# Altium schematic sheet Power.SchDoc: 采集板的电源模块
size A4
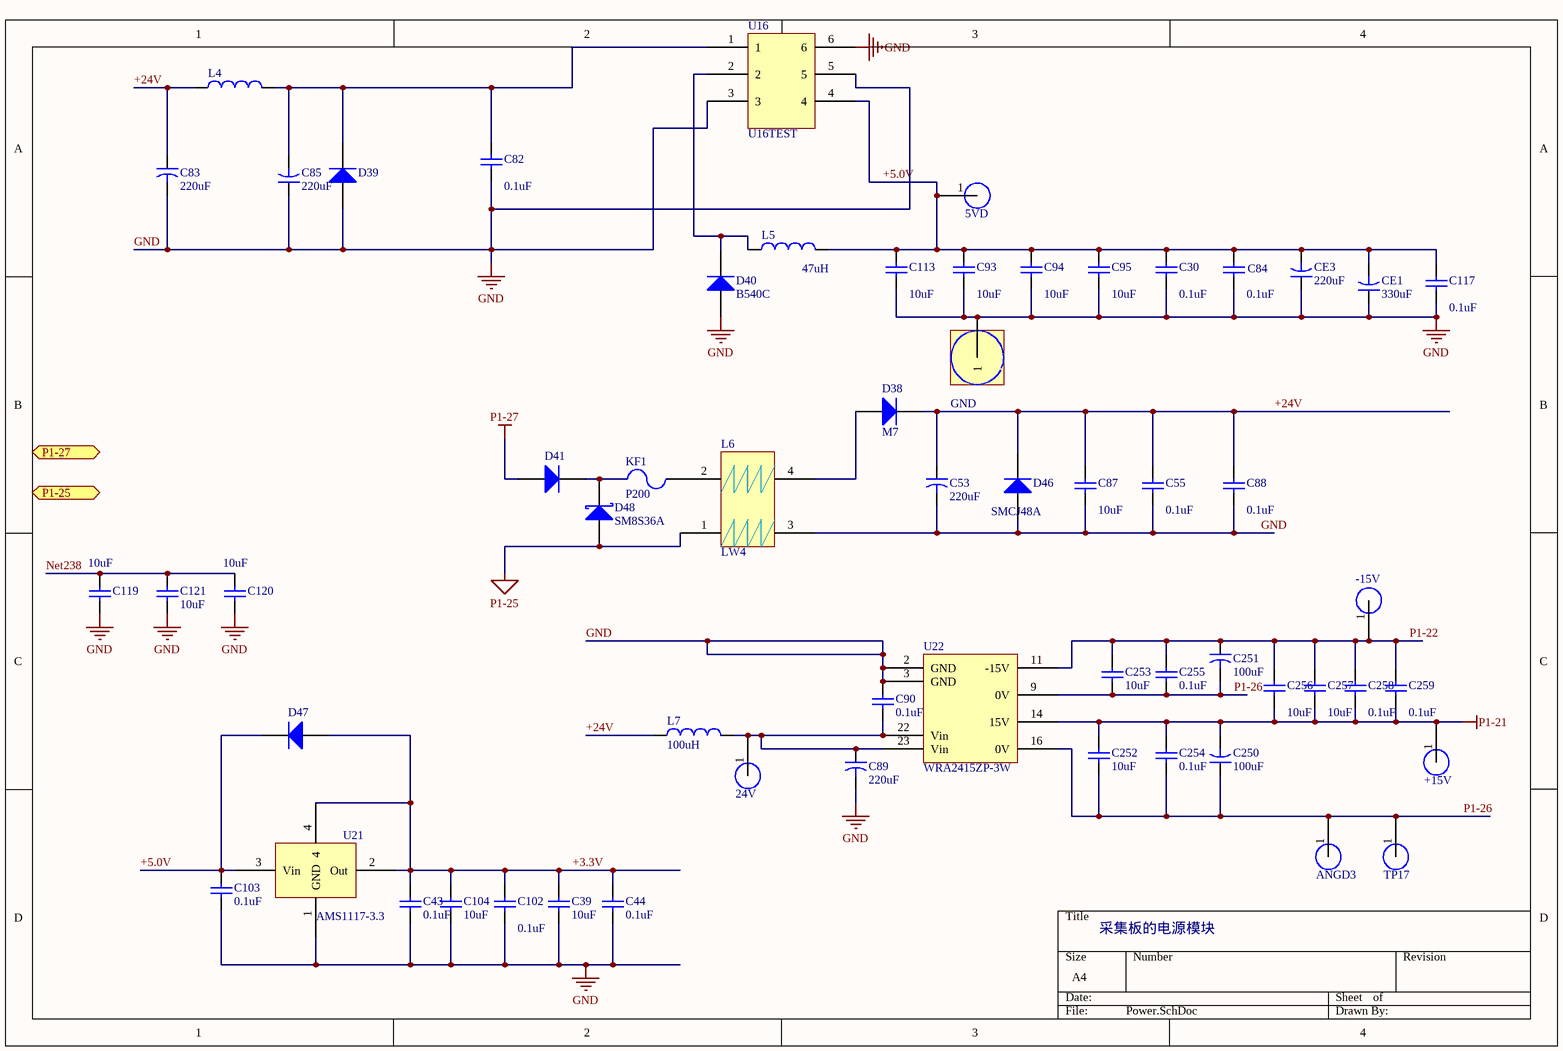
[diagram p0: Power.SchDoc]

## Parts
5VD  PIN  [圆形焊盘]  (value not drawn)
24V  PIN  [圆形焊盘]  (value not drawn)
+15V  PIN  [圆形焊盘]  (value not drawn)
-15V  PIN  [圆形焊盘]  (value not drawn)
ANGD3  PIN  [圆形焊盘]  (value not drawn)
C30  value 0.1uF  [C0805]  (hidden comment: 104/10%)
C39  value 10uF  [C1206]  (hidden comment: Cap)
C43  value 0.1uF  [C0805]  (hidden comment: 104/10%)
C44  value 0.1uF  [C0805]  (hidden comment: Cap)
C53  value 220uF  [8*12]  (hidden comment: Cap2)
C55  value 0.1uF  [C0805]  (hidden comment: 104/10%)
C82  value 0.1uF  [C0805]  (hidden comment: 22pF/5%)
C83  value 220uF  [8*12]  (hidden comment: Cap2)
C84  value 0.1uF  [C0805]  (hidden comment: 104/10%)
C85  value 220uF  [8*12]  (hidden comment: Cap2)
C87  10uF  [C1206]
C88  value 0.1uF  [C0805]  (hidden comment: 104/10%)
C89  value 220uF  [8*12]  (hidden comment: Cap2)
C90  value 0.1uF  [C0805]  (hidden comment: 104/10%)
C93  10uF  [C1206]
C94  10uF  [C1206]
C95  10uF  [C1206]
C102  value 0.1uF  [C0805]  (hidden comment: Cap)
C103  value 0.1uF  [C0805]  (hidden comment: 104/10%)
C104  value 10uF  [C1206]  (hidden comment: Cap)
C113  value 10uF  [C1206]  (hidden comment: Cap)
C117  value 0.1uF  [C0805]  (hidden comment: Cap)
C119  value 10uF  [C1210]  (hidden comment: Cap)
C120  value 10uF  [C1210]  (hidden comment: Cap)
C121  value 10uF  [C1210]  (hidden comment: Cap)
C250  value 100uF  [8*12]  (hidden comment: Cap2)
C251  value 100uF  [8*12]  (hidden comment: Cap2)
C252  10uF  [C1206]
C253  10uF  [C1206]
C254  value 0.1uF  [C0805]  (hidden comment: 104/10%)
C255  value 0.1uF  [C0805]  (hidden comment: 104/10%)
C256  10uF  [C1206]
C257  10uF  [C1206]
C258  value 0.1uF  [C0805]  (hidden comment: 104/10%)
C259  value 0.1uF  [C0805]  (hidden comment: 104/10%)
CE1  value 330uF  [8*12]  (hidden comment: Cap2)
CE3  value 220uF  [8*12]  (hidden comment: Cap2)
D38  M7  [DO214AB]
D39  SMCJ48A  [DO214AB]  (value not drawn)
D40  B540C  [DO214AB]
D41  B540C  [DO214AB]  (value not drawn)
D46  SMCJ48A  [DO214AB]
D47  Diode 1N4007  [SOD123]  (value not drawn)
D48  SM8S36A  [DO-218AB]
GND  TEST  [方形焊盘]  (value not drawn)
KF1  P200  [1812]
L4  101  [7*7]  (value not drawn)
L5  value 47uH  [12.5*12.5]  (hidden comment: SLF12575T-470M2R7-PF)
L6  LW4  [直插共模电感]
L7  value 100uH  [7*7]  (hidden comment: 101)
TP17  PIN  [圆形焊盘]  (value not drawn)
U16  U16TEST  [TOP2-63]
U21  AMS1117-3.3  [SOT-223]
U22  WRA2415ZP-3W  [WRA2415]

## Ports
P1-25, P1-27

## Nets
GND: C30.2 C39.2 C43.1 C44.2 C53.1 C55.1 C82.1 C83.1 C84.2 C85.1 C87.1 C88.1 C89.1 C90.1 C93.2 C94.2 C95.2 C102.1 C103.2 C104.2 C113.1 C117.1 C119.2 C120.2 C121.1 CE1.1 CE3.1 D39.1(A) D40.1(A) D46.1(A) GND.1 L6.3 U16.3 U16.5 U16.6 U21.1(GND) U22.2(GND) U22.3(GND)
P1-21: +15V.1 C250.2 C252.1 C254.1 C256.1 C257.1 C258.1 C259.1 U22.14(15V)
P1-25: D48.2(A) L6.1
P1-27: D41.1(A)
+3.3V: C39.1 C43.2 C44.1 C102.2 C104.1 D47.1(A) U21.2(Out) U21.4
+5.0V: 5VD.1 C30.1 C84.1 C93.1 C94.1 C95.1 C103.1 C113.2 C117.2 CE1.2 CE3.2 D47.2(K) L5.2 U16.4 U21.3(Vin)
+24V: C53.2 C55.2 C83.2 C87.2 C88.2 D38.2(K) D46.2(K) L4.1 L7.1
Net238: C119.1 C120.1 C121.2
P1-22: -15V.1 C251.1 C253.1 C255.1 C256.2 C257.2 C258.2 C259.2 U22.11(-15V)
P1-26: ANGD3.1 C250.1 C251.2 C252.2 C253.2 C254.2 C255.2 TP17.1 U22.9(0V) U22.16(0V)
Net24V_1: 24V.1 C89.2 C90.2 L7.2 U22.22(Vin) U22.23(Vin)
NetC82_2: C82.2 C85.2 D39.2(K) L4.2 U16.1
NetD38_1: D38.1(A) L6.4
NetD40_2: D40.2(K) L5.1 U16.2
NetD41_2: D41.2(K) D48.1(K) KF1.2
NetKF1_1: KF1.1 L6.2

## Library data of the parts
5VD 24V +15V -15V ANGD3 GND TP17 U16 U21 = Component_1
C30 C39 C43 C44 C55 C82 C84 C87 C88 C90 C93-C95 C102-C104 C113 C117 C119-C121 C252-C259 = Cap: Capacitor; Published: 8-Jun-2000; LatestRevisionDate: 17-Jul-2002; LatestRevisionNote: Re-released for DXP Platform.; PackageReference: RAD-0.3; Publisher: Altium Limited
  C87 C93-C95 C252 C253 C256 C257: Value: 10uF
C53 C83 C85 C89 C250 C251 CE1 CE3 = Cap2: Capacitor; Published: 23-Sep-2002; PackageReference: CAPR5-4X5; Publisher: Altium Limited
D38 D40 D41 D47 = Diode 1N4007: 1 Amp General Purpose Rectifier; Published: 8-Jun-2000; LatestRevisionDate: 17-Jul-2002; LatestRevisionNote: Re-released for DXP Platform.; DatasheetDocument: 1998; PackageDocument: Aug-1999; PackageReference: DO-41; Publisher: Altium Limited; Code_JEDEC: DO-204-AL; ComponentLink1Description: Manufacturer Link; ComponentLink1URL: http://www.fairchildsemi.com/; ComponentLink2Description: Datasheet; ComponentLink2URL: http://www.fairchildsemi.com/ds/1N%2F1N4001.pdf
D39 D46 = Diode: Default Diode; Published: 8-Jun-2000; LatestRevisionDate: 17-Jul-2002; LatestRevisionNote: Re-released for DXP Platform.; PackageDocument: Sep-1996; PackageReference: SMC; Publisher: Altium Limited; Code_JEDEC: DO-214-AB
D48 = D Schottky: Schottky Diode; Published: 8-Jun-2000; LatestRevisionDate: 17-Jul-2002; LatestRevisionNote: Re-released for DXP Platform.; PackageReference: SMB; Publisher: Altium Limited; Code_JEDEC: DO-214-AA
KF1 = Fuse 2: Fuse; Published: 8-Jun-2000; LatestRevisionDate: 17-Jul-2002; LatestRevisionNote: Re-released for DXP Platform.; PackageReference: PIN-W2/E2.8; Publisher: Altium Limited
L4 = Inductor: Code_IEC: 1005; Value: 100uH; Published: 8-Jun-2000; LatestRevisionDate: 17-Jul-2002; LatestRevisionNote: Re-released for DXP Platform.; PackageReference: 0402-A; Publisher: Altium Limited; Code_JEITA: 0402
L5 L7 = Inductor: Code_IEC: 1005; Published: 8-Jun-2000; LatestRevisionDate: 17-Jul-2002; LatestRevisionNote: Re-released for DXP Platform.; PackageReference: 0402-A; Publisher: Altium Limited; Code_JEITA: 0402